# Altium schematic sheet 5.WIFI.SchDoc: WIFI
size A; SheetNumber: 5; SheetTotal: 16